# Altium project phone.PrjPcb
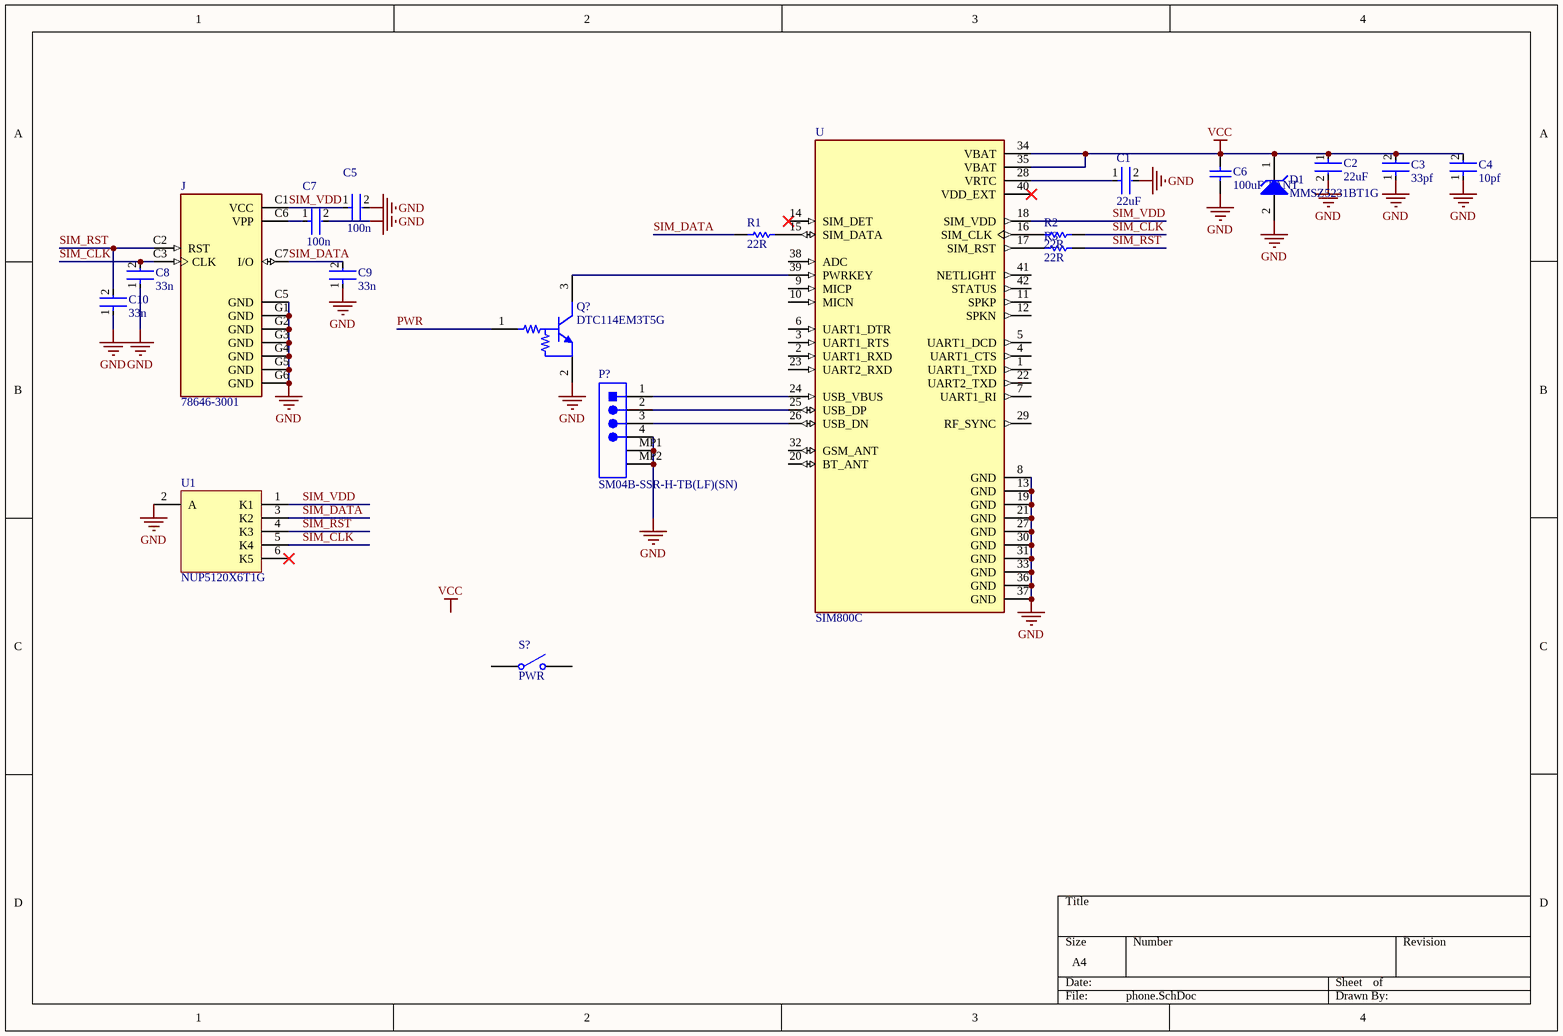
[diagram p0: phone.SchDoc]
1 sheet, 20 parts. Net scope: global (net labels, ports and power ports of the same name join across sheets).

## Sheet phone.SchDoc
size A4; SheetNumber: 1; SheetTotal: 1

### Parts
C1  22uF  [FP-GRM21B-0_15-MFG]
C2  22uF  [FP-GRM21B-0_15-MFG]
C3  33pf  [FP-GRM155-0_05-IPC_A]
C4  10pf  [FP-GRM155-0_05-IPC_A]
C5  100n  [FP-GRM155-0_05-IPC_A]
C6  value 100uF TANT  [CAPMP3525X20N]  (hidden comment: Capacitor)
C7  100n  [FP-GRM155-0_05-IPC_A]
C8  33n  [FP-GRM155-0_05-IPC_A]
C9  33n  [FP-GRM155-0_05-IPC_A]
C10  33n  [FP-GRM155-0_05-IPC_A]
D1  MMSZ5231BT1G  [ONSC-SOD-123-2-425-04_V]
J  78646-3001  [MOLEX_78646-3001]
P?  SM04B-SSR-H-TB(LF)(SN)  [JST-SM04B-SSR-H-TB_V]
Q?  DTC114EM3T5G  [ONSC-SOT-723-3-631AA-01_V]
R1  22R  [RESC1005X40X25NL05T10]
R2  22R  [RESC1005X40X25NL05T10]
R3  22R  [RESC1005X40X25NL05T10]
S?  PWR  [3-6-2.5]
U  SIM800C  [LCC110P1570X1760X250-42N]
U1  NUP5120X6T1G  [ONSC-SOT-563-6-463A-01_V]

### Nets
GND: C1.2 C2.2 C3.1 C4.1 C5.2 C6.2 C7.2 C8.1 C9.1 C10.1 D1.2(A) J.C5(GND) J.G1(GND) J.G2(GND) J.G3(GND) J.G4(GND) J.G5(GND) J.G6(GND) P?.4 P?.MP1 P?.MP2 Q?.2(E) U.8(GND) U.13(GND) U.19(GND) U.21(GND) U.27(GND) U.30(GND) U.31(GND) U.33(GND) U.36(GND) U.37(GND) U1.2(A)
VCC: C2.1 C3.2 C4.2 C6.1 D1.1(K) U.34(VBAT) U.35(VBAT)
PWR: Q?.1(B)
SIM_CLK: C8.2 J.C3(CLK) R2.2 U1.5(K4)
SIM_DATA: C9.2 J.C7(I/O) R1.1 U1.3(K2)
SIM_RST: C10.2 J.C2(RST) R3.2 U1.4(K3)
SIM_VDD: C5.1 J.C1(VCC) U.18(SIM_VDD) U1.1(K1)
NetC1_1: C1.1 U.28(VRTC)
NetC7_1: C7.1 J.C6(VPP)
NetP?_1: P?.1 U.24(USB_VBUS)
NetP?_2: P?.2 U.25(USB_DP)
NetP?_3: P?.3 U.26(USB_DN)
NetQ?_3: Q?.3(C) U.39(PWRKEY)
NetR1_2: R1.2 U.15(SIM_DATA)
NetR2_1: R2.1 U.16(SIM_CLK)
NetR3_1: R3.1 U.17(SIM_RST)

Not connected (* = marked no-connect by the designer): S? 1(COMMON) 2(NO); U 1(UART1_TXD) 2(UART1_RXD) 3(UART1_RTS) 4(UART1_CTS) 5(UART1_DCD) 6(UART1_DTR) 7(UART1_RI) 9(MICP) 10(MICN) 11(SPKP) 12(SPKN) 14(SIM_DET)* 20(BT_ANT) 22(UART2_TXD) 23(UART2_RXD) 29(RF_SYNC) 32(GSM_ANT) 38(ADC) 40(VDD_EXT)* 41(NETLIGHT) 42(STATUS); U1 6(K5)*

### Notes on the sheet
- Labels drawn without touching a wire or pin: VCC

### Library data of the parts
C1 C2 = CMP-2007-03385-2: Chip Multilayer Ceramic Capacitors for General Purpose, 0805, 22uF, X5R, 15%, 20%, 6.3V; Material: Ceramic; Max Operating Temperature: 85°C; Voltage: 6.3V; Min Operating Temperature: -55°C; Case/Package: 0805; Thickness: 0.053inch; Dielectric: X5R; Packaging: Tape and Reel; Depth: 1.25mm; Termination: SMD/SMT; Voltage Rating (DC): 6.3V; Radiation Hardening: No; Tolerance: 20%; Mount: Surface Mount; Lead Free: Lead Free; Package Quantity: 1; REACH SVHC: No SVHC; Voltage Rating: 6.3V; Capacitance: 22uF; Length: 2mm; Case Code (Imperial): 0805; Case Code (Metric): 2012; Width: 0.049inch; Height: 1.25mm
C3-C5 C7-C10 = CMP-2008-04369-2: Chip Multilayer Ceramic Capacitors for General Purpose, 0402, 470pF, C0G, 30ppm/°C, 5%, 50V; Insulation Resistance: 10GR; Depth: 0.5mm; Voltage Rating: 50V; Packaging: Tape and Reel; Material: Ceramic; Lead Free: Lead Free; Max Operating Temperature: 125°C; Length: 1mm; Min Operating Temperature: -55°C; Height: 0.5mm; Width: 0.5mm; Thickness: 0.022inch; Voltage: 50V; Termination: SMD/SMT; Dielectric Material: Ceramic; REACH SVHC: No SVHC; Voltage Rating (DC): 50V; Package Quantity: 1; Dielectric: C0G; Radiation Hardening: No; Mount: Surface Mount; Case/Package: 0402; Number of Pins: 2; Tolerance: 5%; Temperature Coefficient: 30ppm/°C; Case Code (Metric): 1005; Capacitance: 470pF; Case Code (Imperial): 0402
C6 = Capacitor: SimulationGenericComponent: True
D1 = CMP-1060-00573-1: Zener Voltage Regulator, 500 mW, 2-Pin SOD-123, Pb-Free, Tape and Reel; Manufacturer: On Semiconductor; P Max (W): 0.5; VZ Typ (V): 5.1; PackageVersion: Rev. G, 10/2009; Mounting Technology: Surface Mount; ComponentLink2Description: Datasheet; ComponentLink3URL: http://www.onsemi.com/pub_link/Collateral/425-04.PDF; PackageDescription: 2-Pin SOD, Body 1.6 x 2.69 mm; Packing: Tape and Reel; ComponentLink2URL: http://www.onsemi.com/pub_link/Collateral/MMSZ5221BT1-D.PDF; ComponentLink1URL: http://www.onsemi.com/; PartNumber: MMSZ5231BT1G; PackageReference: SOD-123-2-425-04; RoHS: Pb-Free; ComponentLink1Description: Manufacturer URL; ComponentLink3Description: Package Specification; DatasheetVersion: Rev. 12
J = 78646-3001: 6 Position Card Connector Micro SIM Surface Mount, Right Angle Gold; MF: Molex; Price: None; Availability: Unavailable; Package: None; MP: 78646-3001; Value: *; SnapEDA_Link: https://www.snapeda.com/parts/78646-3001/Molex/view-part/75189/?ref=snap
P? = CMP-2000-07079-1: SSR Connector, Pitch 1 mm, 1 x 4 Position, Height 2 mm, -20 to 85 degC, RoHS, Tape and Reel; Manufacturer: JST; Style/Orientation: Plug; Pitch: 1mm; No of Positions: 4; Datasheet URL: http://www.jst-mfg.com/product/pdf/eng/eSSR.pdf; Package Reference: SM04B-SSR-H-TB; Type: WiretoBoard; Package Description: SSR Connector, Pitch 1 mm, 1 x 4 Position, Height 2 mm; Datasheet Version: 11/2010; Mounting Technology: SurfaceMount; Termination: IDC; Manufacturer URL: http://www.jst.com/home2.html
Q? = CMP-0630-00443-1: Digital Transistor (BRT), R1=10 kOhm, R2=10 kOhm, NPN Transistor, 3-Pin SOT-723, Pb-Free, Tape and Reel; Manufacturer: On Semiconductor; V(BR)CEO Min (V): 50; R1/R2 Typ: 1; IC Continuous (A): 0.1; hFE Min: 35; ComponentLink3Description: Package Specification; Packing: Tape and Reel; ComponentLink1Description: Manufacturer URL; DatasheetVersion: Rev. 5; PackageDescription: 3-Pin Small Outline Transistor, Body 1.2 x 0.8 mm, Pitch 0.4 mm; RoHS: TRUE; Mounting Technology: Surface Mount; ComponentLink2URL: http://www.onsemi.cn/pub_link/Collateral/DTC114E-D.PDF; ComponentLink2Description: Datasheet; ComponentLink1URL: http://www.onsemi.com/; Polarity: NPN; PackageVersion: Rev. D, 08/2009; PartNumber: DTC114EM3T5G; PackageReference: SOT-723-3-631AA-01; ComponentLink3URL: http://www.onsemi.com/pub_link/Collateral/631AA.PDF
R1-R3 = CMP-1011-00001-2: Manufacturer: Yageo / Phycomp; Part Number: RC0402JR-070RL
S? = SW-SPST: Single-Pole, Single-Throw Switch; Published: 24-Mar-1999; LatestRevisionDate: 17-Jul-2002; LatestRevisionNote: Re-released for DXP Platform.; PackageReference: SPST-2; Publisher: Altium Limited; PackageDescription: Switch; 2 Leads
U = SIM800C: Module: GSM/Bluetooth; GPRS; 2G; 1800MHz, 900MHz; 85.6kbps; SMD; MF: Simcom; MP: SIM800C; Availability: Unavailable; Package: None; Value: *; Price: None; SnapEDA_Link: https://www.snapeda.com/parts/SIM800C/SIMcom%20Wireless%20solutions%20Co.%2CLtd/view-part/571323/?ref=snap
U1 = CMP-1063-00205-1: 5-Line Transient Voltage Suppressor Array, 6-Pin SOT-563, Pb-Free, Tape and Reel; Manufacturer: On Semiconductor; IR Max (uA): 0.5; VRWM Max (V): 5; PPK Max (W): 90; Direction: Unidirectional; V(BR) Min (V): 6.2; C Max (pF): 70; ComponentLink2Description: Datasheet; ComponentLink2URL: http://www.onsemi.com/pub_link/Collateral/NUP5120-D.PDF; ComponentLink3Description: Package Specification; Number of Lines: 5; Packing: Tape and Reel; ComponentLink1Description: Manufacturer URL; PackageDescription: 6-Pin Small Outline Transistor, Body 1.6 x 1.2 mm, Pitch 0.5 mm; ComponentLink1URL: http://www.onsemi.com/; PackageReference: SOT-563-6-463A-01; DatasheetVersion: Rev. 4; ComponentLink3URL: http://www.onsemi.cn/pub_link/Collateral/463A-01.PDF; Mounting Technology: Surface Mount; RoHS: Pb-Free; PartNumber: NUP5120X6T1G; PackageVersion: Rev. F, 04/2005